# Altium project DRF1605_KIT.PrjPcb
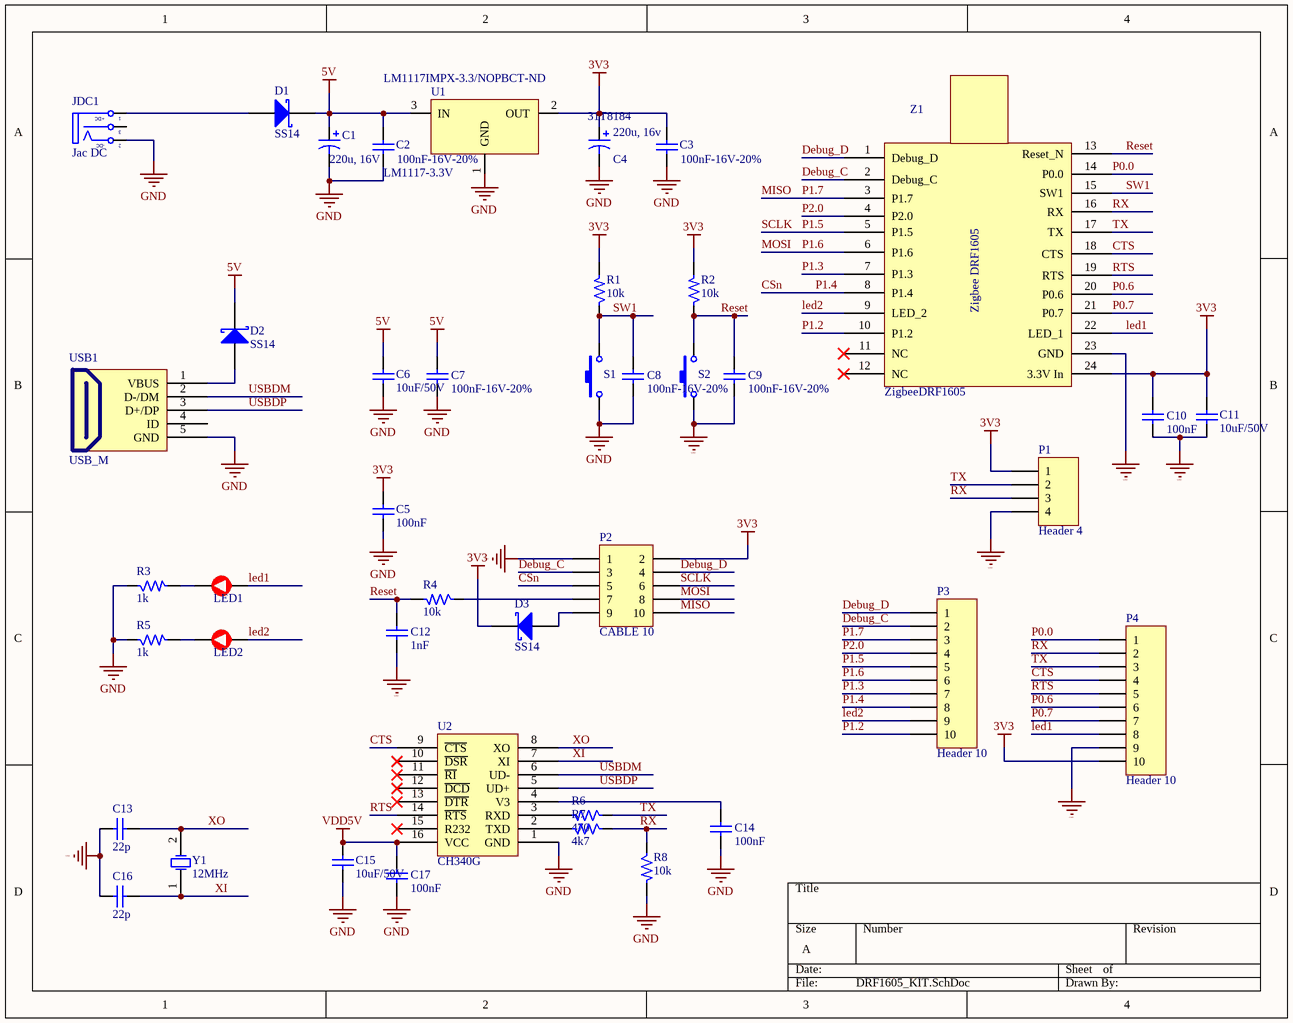
[diagram p0: DRF1605_KIT.SchDoc]
1 sheet, 42 parts. Net scope: global (net labels, ports and power ports of the same name join across sheets).
Board file: DRF1605_KIT.PcbDoc

## Sheet DRF1605_KIT.SchDoc
size A

### Parts
C1  value 220u, 16V  [CAP TANTALUM 7343]  (hidden comment: Cap Pol3)
C2  100nF-16V-20%  [C0805]
C3  100nF-16V-20%  [C0805]
C4  220u, 16v  Supplier Part Number 1: 31T8184  [CAP TANTALUM 7343]
C5  100nF  [C0805]
C6  10uF/50V  [C1206]
C7  100nF-16V-20%  [C0805]
C8  100nF-16V-20%  [C0805]
C9  100nF-16V-20%  [C0805]
C10  100nF  [C0805]
C11  10uF/50V  [C1206]
C12  1nF  [C0805]
C13  22p  [C0805]
C14  100nF  [C0805]
C15  10uF/50V  [C1206]
C16  22p  [C0805]
C17  100nF  [C0805]
D1  SS14  [DO-214AC (SMA)]
D2  SS14  [DO-214AC (SMA)]
D3  SS14  [DO-214AC (SMA)]
JDC1  Jac DC  [DC-IN]
LED1  (no value)  [LedBlue5]
LED2  (no value)  [LedRed5]
P1  Header 4  [HDR1X4]
P2  CABLE 10  [CABLE 10]
P3  Header 10  [HDR1X10]
P4  Header 10  [HDR1X10]
R1  10k  [R0805]
R2  10k  [R0805]
R3  1k  [R0805]
R4  10k  [R0805]
R5  1k  [R0805]
R6  470  [R0805]
R7  4k7  [R0805]
R8  10k  [R0805]
S1  SW-SMD  [Button Tactile Switch]  (value not drawn)
S2  SW-SMD  [Button Tactile Switch]  (value not drawn)
U1  LM1117-3.3V  Supplier Part Number 1: LM1117IMPX-3.3/NOPBCT-ND  [LM1117-SOP]
U2  CH340G  [SOP-16]
USB1  USB_M  [USB_B_MINI_SMD]
Y1  12MHz  [XT2 SMD]
Z1  ZigbeeDRF1605  [DRF1605]

### Nets
3V3: C3.1 C4.1 C5.1 C10.1 C11.1 D3.2(K) P1.1 P2.2 P4.10 R1.2 R2.2 U1.2(OUT) Z1.24(3.3V_In)
5V: C1.1 C2.1 C6.1 C7.1 D1.2(K) D2.2(K) U1.3(IN)
GND: C1.2 C2.2 C3.2 C4.2 C5.2 C6.2 C7.2 C8.2 C9.2 C10.2 C11.2 C12.2 C13.1 C14.2 C15.2 C16.1 C17.2 JDC1.2(TN) P1.4 P2.1 P4.9 R3.1 R5.1 R8.2 S1.1 S2.1 U1.1(GND) U2.1(GND) USB1.5(GND) Z1.23(GND)
VDD5V: C15.1 C17.1 U2.16(VCC)
CSn: P2.5 P3.8 Z1.8(P1.4)  [also labelled P1.4]
CTS: P4.4 U2.9(~{CTS}) Z1.18(CTS)
Debug_C: P2.3 P3.2 Z1.2(Debug_C)
Debug_D: P2.4 P3.1 Z1.1(Debug_D)
led1: LED1.2 P4.8 Z1.22(LED_1)
led2: LED2.2 P3.9 Z1.9(LED_2)
MISO: P2.10 P3.3 Z1.3(P1.7)  [also labelled P1.7]
MOSI: P2.8 P3.6 Z1.6(P1.6)  [also labelled P1.6]
P0.0: P4.1 Z1.14(P0.0)
P0.6: P4.6 Z1.20(P0.6)
P0.7: P4.7 Z1.21(P0.7)
P1.2: P3.10 Z1.10(P1.2)
P1.3: P3.7 Z1.7(P1.3)
P1.5: P2.6 P3.5 Z1.5(P1.5)  [also labelled SCLK]
P2.0: P3.4 Z1.4(P2.0)
Reset: C9.1 C12.1 R2.1 R4.2 S2.2 Z1.13(Reset_N)
RTS: P4.5 U2.14(~{RTS}) Z1.19(RTS)
RX: P1.3 P4.2 R7.1 R8.1 Z1.16(RX)
SW1: C8.1 R1.1 S1.2 Z1.15(SW1)
TX: P1.2 P4.3 R6.1 Z1.17(TX)
USBDM: U2.6(UD-) USB1.2(D-/DM)
USBDP: U2.5(UD+) USB1.3(D+/DP)
XI: C16.2 U2.7(XI) Y1.1(OSC1)
XO: C13.2 U2.8(XO) Y1.2(OSC2)
NetC14_1: C14.1 U2.4(V3)
NetD1_1: D1.1(A) JDC1.1(T)
NetD2_1: D2.1(A) USB1.1(VBUS)
NetD3_1: D3.1(A) P2.9
NetLED1_1: LED1.1 R3.2
NetLED2_1: LED2.1 R5.2
NetP2_7: P2.7 R4.1
NetR6_2: R6.2 U2.3(RXD)
NetR7_2: R7.2 U2.2(TXD)

Not connected (* = marked no-connect by the designer): JDC1 3(S); U2 10(~{DSR})* 11(~{RI})* 12(~{DCD})* 13(~{DTR})* 15(R232)*; USB1 4(ID); Z1 11(NC)* 12(NC)*

### Notes on the sheet
- (in symbol DCIN) +DC; -DC
- (in symbol DRF1605) Zigbee DRF1605

### Library data of the parts
C1 = Cap Pol3: Polarized Capacitor (Surface Mount); Manufacturer: Kemet; Manufacturer Part Number: C0603C103K5RACTU; Capacitance: 10000pF; Voltage - Rated: 50V; Tolerance: ±10%; Temperature Coefficient: X7R; Published: 8-Jun-2000; LatestRevisionDate: 29-May-2009; LatestRevisionNote: IPC-7351 Footprint Added.; PackageReference: C0805; Publisher: Altium Limited; PackageDescription: Chip Capacitor; Supplier 1: Digi-Key; Supplier Part Number 1: 399-1091-1-ND; RoHS: RoHS Compliant; Category: Capacitors; Stock 1: 1592048; Pricing 1: 1=0.1, 10=0.019, 50=0.0104, 100=0.0088, 250=0.0072, 500=0.00616, 1000=0.0048 (USD); Packaging: Cut Tape (CT); Mounting Type: Surface Mount, MLCC; Operating Temperature: -55°C ~ 125°C; Applications: General Purpose; Ratings: -; Package/Case: 0603 (1608 Metric); Size / Dimension: 0.063" L x 0.031" W (1.60mm x 0.80mm); Height - Seated (Max): -; Thickness (Max): 0.034" (0.87mm); Lead Spacing: -; Features: -; Lead Style: -; ComponentLink1URL: http://www.kemet.com/datasheets&C0603C103K5RACTU; ComponentLink1Description: http://www.kemet.com/datasheets&C0603C103K5RACTU; Supplier 2: Digi-Key; Supplier Part Number 2: 587-2994-1-ND; Stock 2: 102954; Pricing 2: 1=0.28, 10=0.19, 50=0.115, 100=0.0966, 250=0.0782, 500=0.069, 1000=0.05865 (USD); ComponentLink2URL: http://www.yuden.co.jp/or/product/category/capacitor/UMK316AB7475KL-T.pdf; ComponentLink2Description: http://www.yuden.co.jp/or/product/category/capacitor/UMK316AB7475KL-T.pdf
C2 C3 C5 C7-C10 C12 C14 C17 = Cap: CAP CER 0.1UF 16V Y5V 0603; Manufacturer: Yageo; Manufacturer Part Number: CC0603ZRY5V7BB104; Published: 8-Jun-2000; LatestRevisionDate: 17-Jul-2002; LatestRevisionNote: Re-released for DXP Platform.; PackageReference: C0603; Publisher: Altium Limited; Digi-Key Part Number: 311-1369-1-ND; Unit Price: 0.00648
  C2 C3 C7-C9: Value: 100nF-16V-20%
  C5 C10 C14 C17: Value: 100nF
  C12: Value: 1nF
C4 = Cap Pol3: Polarized Capacitor (Surface Mount); Published: 8-Jun-2000; LatestRevisionDate: 29-May-2009; LatestRevisionNote: IPC-7351 Footprint Added.; PackageReference: C0805; Publisher: Altium Limited; PackageDescription: Chip Capacitor; Supplier 1: Newark
C6 C11 C15 = Cap Semi: Capacitor 100n 16V 0603; Published: 8-Jun-2000; LatestRevisionDate: 29-May-2009; LatestRevisionNote: IPC-7351 Footprint Added.; PackageReference: C1206; Publisher: Altium Limited; PackageDescription: Chip Capacitor
C13 C16 = Cap Semi: Capacitor (Semiconductor SIM Model); Published: 8-Jun-2000; LatestRevisionDate: 29-May-2009; LatestRevisionNote: IPC-7351 Footprint Added.; PackageReference: C1206; Publisher: Altium Limited; PackageDescription: Chip Capacitor
D1-D3 = D Schottky: Schottky Diode; Published: 8-Jun-2000; LatestRevisionDate: 17-Jul-2002; LatestRevisionNote: Re-released for DXP Platform.; PackageReference: SMB; Publisher: Altium Limited; Code_JEDEC: DO-214-AA
JDC1 = DCIN: Jac DC input; Value: Jac DC
LED1 LED2 = Led: Manufacturer No: HT204SURD; Manufacturer: Harvatek; Color: RED; Wavelength: 630nm; Brightness: 30-200 mcd; Size: 3mm; Specification: ="Color"+" " +"Wavelength"+" "+"Brightness"
P1 = Header 4: Header, 4-Pin; LatestRevisionDate: 17-Jul-2002; LatestRevisionNote: Re-released for DXP Platform.; Publisher: Altium Limited
P2 = CABLE 10: Header, 5-Pin, Dual row; LatestRevisionDate: 17-Jul-2002; LatestRevisionNote: Re-released for DXP Platform.; Publisher: Altium Limited
P3 P4 = Header 10: Header, 10-Pin; LatestRevisionDate: 17-Jul-2002; LatestRevisionNote: Re-released for DXP Platform.; Publisher: Altium Limited
R1-R8 = RM: Resistor SMD; Manufacturer No: RM10JTN102; Manufacturer: UniOhm; Power Rating: 1/10W; Specification: ="Value" + "  "+ "Power Rating"
  R1 R2 R4 R8: Value: 10k
  R3 R5: Value: 1k
  R6: Value: 470
  R7: Value: 4k7
S1 S2 = SW-SMD: Switch; Published: 24-Mar-1999; LatestRevisionDate: 17-Jul-2002; LatestRevisionNote: Re-released for DXP Platform.; PackageReference: SPST-2; Publisher: Altium Limited
U1 = LM1117: 800mA Low-Dropout Linear Regulator; Creator: Nguyen Ba Bien; Website: http://group3i.net; Supplier 1: Digi-Key
U2 = CH340G: CH340G USB to serial (UART) bridge
Y1 = XTAL: Crystal Oscillator; Published: 8-Jun-2000; LatestRevisionDate: 17-Jul-2002; LatestRevisionNote: Re-released for DXP Platform.; PackageReference: R38; Publisher: Altium Limited; Supplier 1: Newark; Supplier Part Number 1: 90B5422
Z1 = DRF1605